# Altium schematic sheet mega2560pro_IoT_schematic.schdoc
size A3
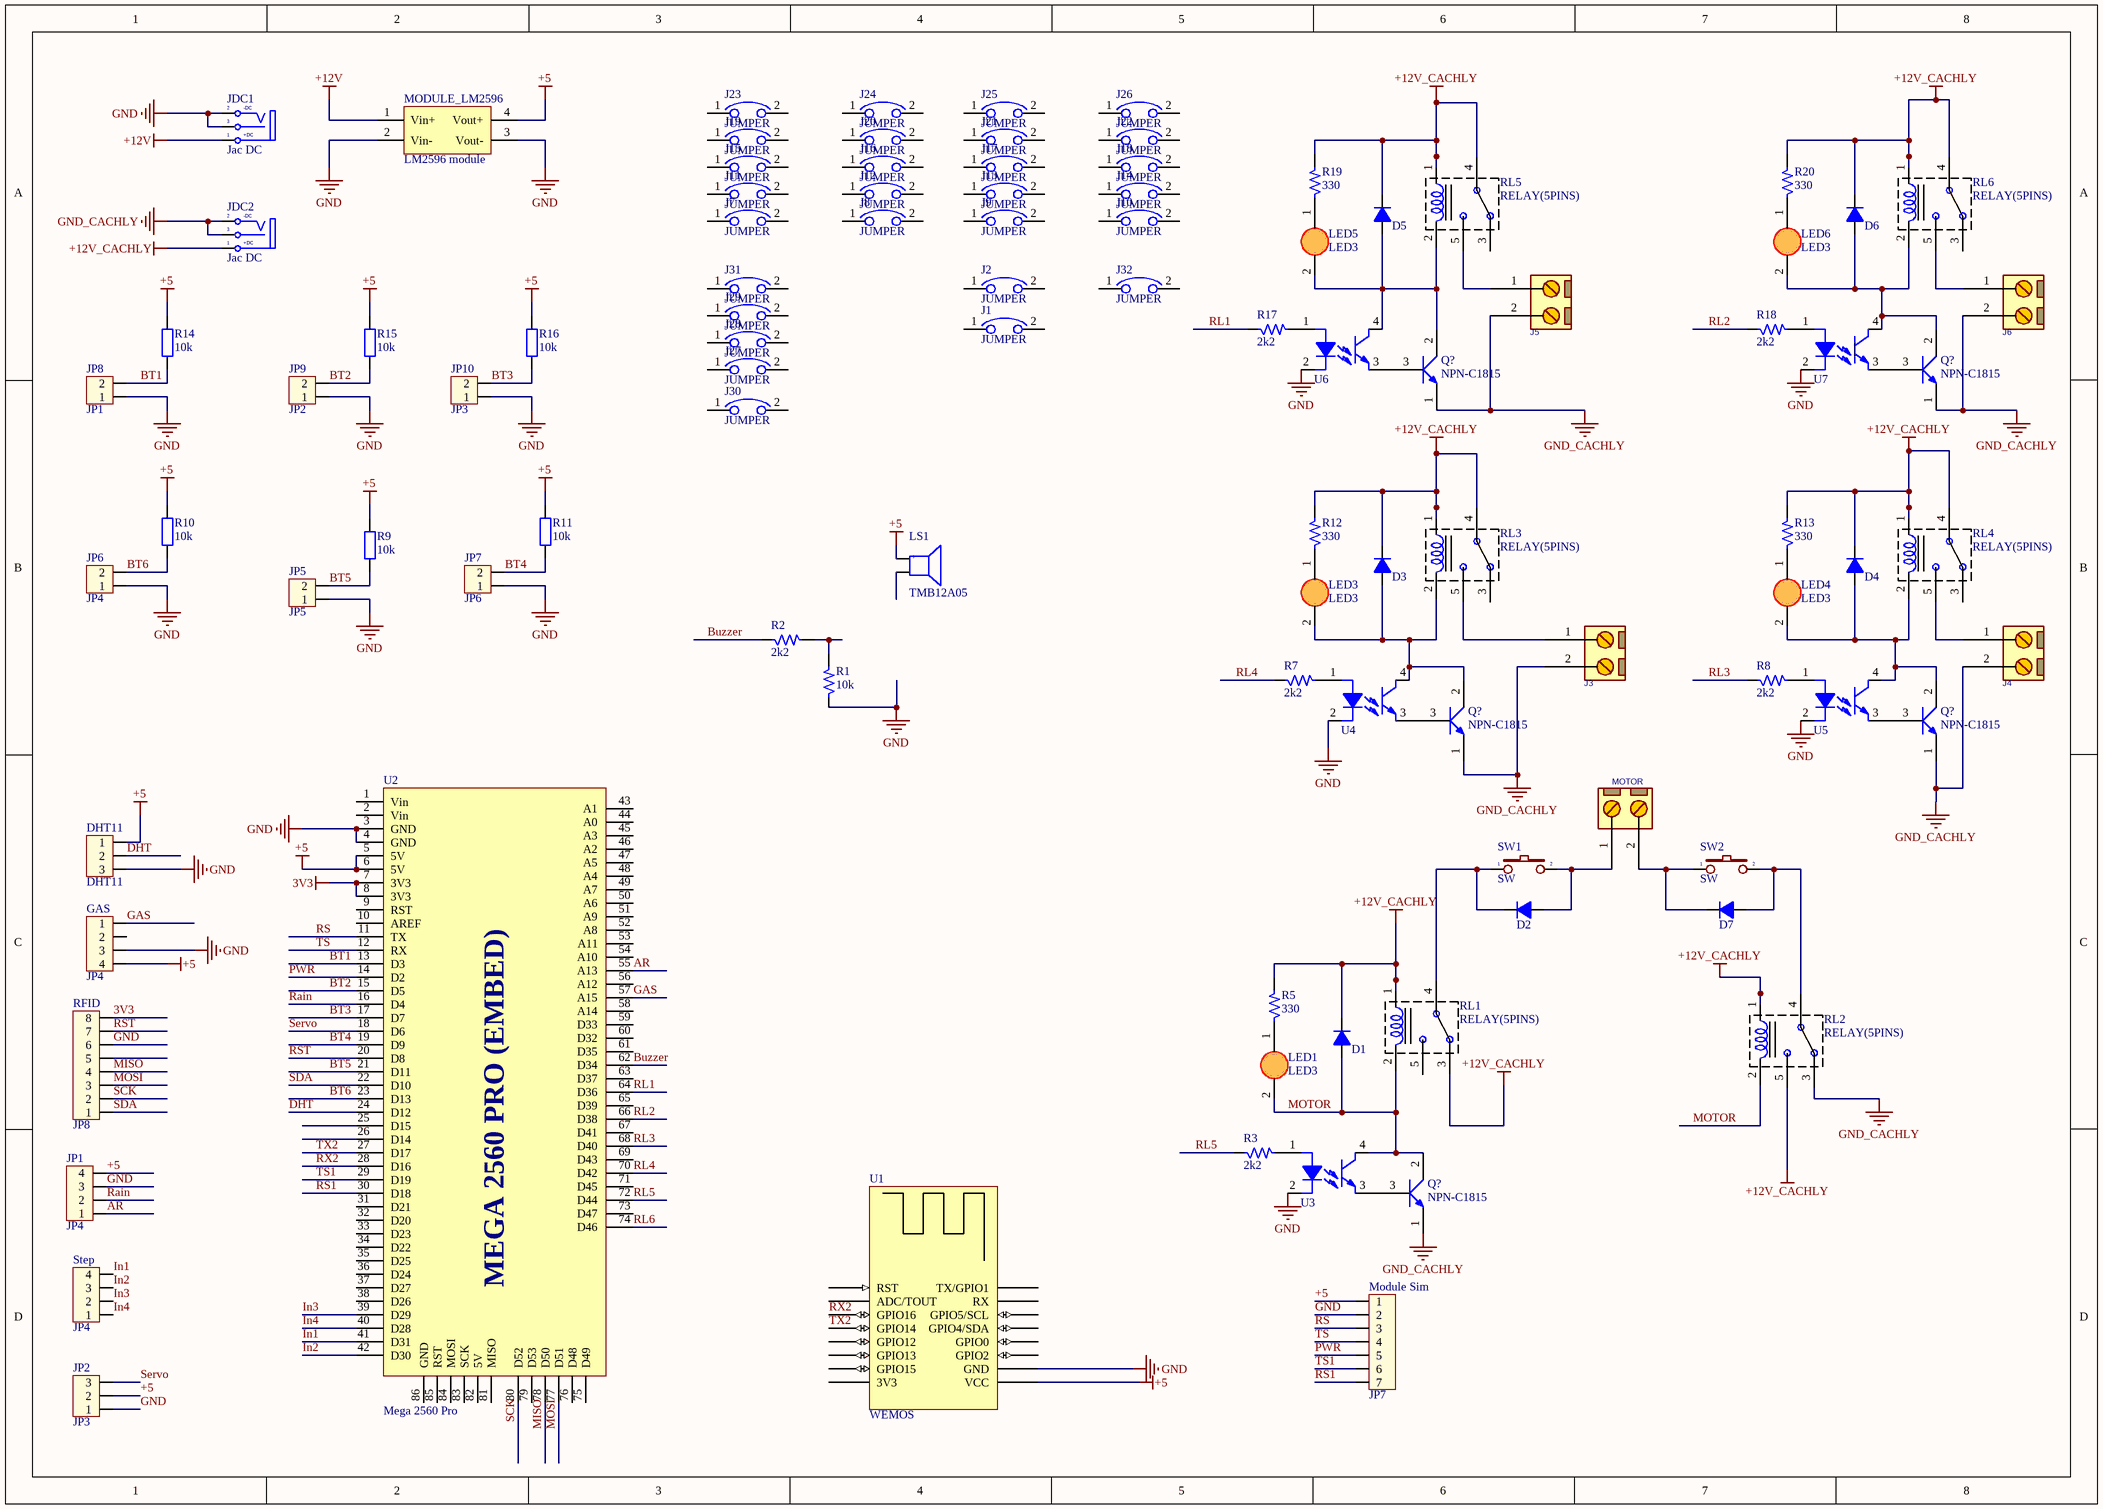
[diagram p0: mega2560pro_IoT_schematic.schdoc]

## Parts
(Parts that share a designator on the sheet are numbered #1, #2 ... from top to bottom, then left to right.)
D1  Diode  [DIODE4007_350MIL]  (value not drawn)
D2  Diode  [DIODE4007_350MIL]  (value not drawn)
D3  Diode  [DIODE4007_350MIL]  (value not drawn)
D4  Diode  [DIODE4007_350MIL]  (value not drawn)
D5  Diode  [DIODE4007_350MIL]  (value not drawn)
D6  Diode  [DIODE4007_350MIL]  (value not drawn)
D7  Diode  [DIODE4007_350MIL]  (value not drawn)
DHT11  DHT11  [CON3]
GAS  JP4  [CON4]
J1  JUMPER  [jumper 15mm]
J2  JUMPER  [jumper 15mm]
J3  CONN_TB2  [Medium - Header 2]  (value not drawn)
J4  CONN_TB2  [Medium - Header 2]  (value not drawn)
J5  CONN_TB2  [Medium - Header 2]  (value not drawn)
J6  CONN_TB2  [Medium - Header 2]  (value not drawn)
J7  JUMPER  [jumper 5mm]
J8  JUMPER  [jumper 10mm]
J9  JUMPER  [jumper 6mm]
J10  JUMPER  [jumper 20mm]
J11  JUMPER  [jumper 5mm]
J12  JUMPER  [jumper 10mm]
J13  JUMPER  [jumper 15mm]
J14  JUMPER  [jumper 15mm]
J15  JUMPER  [jumper 5mm]
J16  JUMPER  [jumper 10mm]
J17  JUMPER  [jumper 15mm]
J18  JUMPER  [jumper 20mm]
J19  JUMPER  [jumper 5mm]
J20  JUMPER  [jumper 10mm]
J21  JUMPER  [jumper 8mm]
J22  JUMPER  [jumper 10mm]
J23  JUMPER  [jumper 5mm]
J24  JUMPER  [jumper 18mm]
J25  JUMPER  [jumper 15mm]
J26  JUMPER  [jumper 8mm]
J27  JUMPER  [jumper 10mm]
J28  JUMPER  [jumper 20mm]
J29  JUMPER  [jumper 10mm]
J30  JUMPER  [jumper 15mm]
J31  JUMPER  [jumper 10mm]
J32  JUMPER  [jumper 20mm]
JDC1  Jac DC  [DC-IN]
JDC2  Jac DC  [DC-IN]
JP1  JP4  [CON4(XH)]
JP2  JP3  [CON3]
JP5  JP5  [CON2]
JP6  JP4  [CON2]
JP7  JP6  [CON2]
JP8  JP1  [CON2]
JP9  JP2  [CON2]
JP10  JP3  [CON2]
LED1  LED3  [LED3mm]
LED3  LED3  [LED3mm]
LED4  LED3  [LED3mm]
LED5  LED3  [LED3mm]
LED6  LED3  [LED3mm]
LS1  TMB12A05  [Buzzer]
MODULE_LM2596  LM2596 module  [Module-2596]
Module_Sim  JP7  [CON7(XH)]
MOTOR  CONN_TB2  [Medium - Header 2]  (value not drawn)
Q?#1  NPN-C1815  [TO126-ECB(D882)]
Q?#2  NPN-C1815  [TO126-ECB(D882)]
Q?#3  NPN-C1815  [TO126-ECB(D882)]
Q?#4  NPN-C1815  [TO126-ECB(D882)]
Q?#5  NPN-C1815  [TO126-ECB(D882)]
R1  10k  [R1/4W_350MIL]
R2  2k2  [R1/4W_350MIL]
R3  2k2  [R1/4W_350MIL]
R5  330  [R1/4W_350MIL]
R7  2k2  [R1/4W_350MIL]
R8  2k2  [R1/4W_350MIL]
R9  10k  [R1/4W]
R10  10k  [R1/4W]
R11  10k  [R1/4W]
R12  330  [R1/4W_350MIL]
R13  330  [R1/4W_350MIL]
R14  10k  [R1/4W]
R15  10k  [R1/4W]
R16  10k  [R1/4W]
R17  2k2  [R1/4W_350MIL]
R18  2k2  [R1/4W_350MIL]
R19  330  [R1/4W_350MIL]
R20  330  [R1/4W_350MIL]
RFID  JP8  [CON8(XH8)]
RL1  RELAY(5PINS)  [RELAY(YL303H-12VDC-5PINS)]
RL2  RELAY(5PINS)  [RELAY(YL303H-12VDC-5PINS)]
RL3  RELAY(5PINS)  [RELAY(YL303H-12VDC-5PINS)]
RL4  RELAY(5PINS)  [RELAY(YL303H-12VDC-5PINS)]
RL5  RELAY(5PINS)  [RELAY(YL303H-12VDC-5PINS)]
RL6  RELAY(5PINS)  [RELAY(YL303H-12VDC-5PINS)]
Step  JP4  [CON4]
SW1  SW  [SW2]
SW2  SW  [SW2]
U1  WEMOS  [MODULE WEMOS]
U2  Mega 2560 Pro  [Arduino 2560 pro]
U3  PC817  [DIP.100/4/W.300/L.400]  (value not drawn)
U4  PC817  [DIP.100/4/W.300/L.400]  (value not drawn)
U5  PC817  [DIP.100/4/W.300/L.400]  (value not drawn)
U6  PC817  [DIP.100/4/W.300/L.400]  (value not drawn)
U7  PC817  [DIP.100/4/W.300/L.400]  (value not drawn)

## Nets
3V3: RFID.8 U2.7(3V3) U2.8(3V3)
+5: DHT11.1 GAS.4 JP1.4 JP2.2 LS1.1(+) MODULE_LM2596.4(Vout+) Module_Sim.1 R9.2 R10.2 R11.2 R14.2 R15.2 R16.2 U1.15(VCC) U2.5(5V) U2.6(5V)
+12V: JDC1.1(T) MODULE_LM2596.1(Vin+)
+12V_CACHLY: D1.2(K) D3.2(K) D4.2(K) D5.2(K) D6.2(K) JDC2.1(T) R5.2 R12.2 R13.2 R19.2 R20.2 RL1.1 RL1.3 RL2.1 RL2.5 RL3.1 RL3.4 RL4.1 RL4.4 RL5.1 RL5.4 RL6.1 RL6.4
GND: DHT11.3 GAS.3 JDC1.2(TN) JDC1.3(S) JP1.3 JP2.1 JP5.1 JP6.1 JP7.1 JP8.1 JP9.1 JP10.1 MODULE_LM2596.2(Vin-) MODULE_LM2596.3(Vout-) Module_Sim.2 R1.1 RFID.6 U1.16(GND) U2.3(GND) U2.4(GND) U3.2 U4.2 U5.2 U6.2 U7.2
GND_CACHLY: J3.2 J4.2 J5.2 J6.2 JDC2.2(TN) JDC2.3(S) Q?#1.1 Q?#2.1 Q?#3.1 Q?#4.1 Q?#5.1 RL2.3
AR: JP1.1 U2.55(A13)
BT1: JP8.2 R14.1 U2.13(D3)
BT2: JP9.2 R15.1 U2.15(D5)
BT3: JP10.2 R16.1 U2.17(D7)
BT4: JP7.2 R11.1 U2.19(D9)
BT5: JP5.2 R9.1 U2.21(D11)
BT6: JP6.2 R10.1 U2.23(D13)
Buzzer: R2.1 U2.62(D34)
DHT: DHT11.2 U2.24(D12)
GAS: GAS.1 U2.57(A15)
In1: Step.4 U2.41(D31)
In2: Step.3 U2.42(D30)
In3: Step.2 U2.39(D29)
In4: Step.1 U2.40(D28)
MISO: RFID.4 U2.78(D50)
MOSI: RFID.3 U2.77(D51)
MOTOR: D1.1(A) LED1.2(K) Q?#5.2 RL1.2 RL2.2 U3.4
PWR: Module_Sim.5 U2.14(D2)
Rain: JP1.2 U2.16(D4)
RL1: R17.1 U2.64(D36)
RL2: R18.1 U2.66(D38)
RL3: R8.1 U2.68(D40)
RL4: R7.1 U2.70(D42)
RL5: R3.1 U2.72(D44)
RL6: U2.74(D46)
RS: Module_Sim.3 U2.11(TX)
RS1: Module_Sim.7 U2.30(D18)
RST: RFID.7 U2.20(D8)
RX2: U1.3(GPIO16) U2.28(D16)
SCK: RFID.2 U2.80(D52)
SDA: RFID.1 U2.22(D10)
Servo: JP2.3 U2.18(D6)
TS: Module_Sim.4 U2.12(RX)
TS1: Module_Sim.6 U2.29(D19)
TX2: U1.4(GPIO14) U2.27(D17)
NetD2_1: D2.1(A) MOTOR.1 SW1.2
NetD2_2: D2.2(K) RL1.4 SW1.1
NetD3_1: D3.1(A) LED3.2(K) Q?#3.2 RL3.2 U4.4
NetD4_1: D4.1(A) LED4.2(K) Q?#4.2 RL4.2 U5.4
NetD5_1: D5.1(A) LED5.2(K) Q?#1.2 RL5.2 U6.4
NetD6_1: D6.1(A) LED6.2(K) Q?#2.2 RL6.2 U7.4
NetD7_1: D7.1(A) RL2.4 SW2.2
NetD7_2: D7.2(K) MOTOR.2 SW2.1
NetJ3_1: J3.1 RL3.5
NetJ4_1: J4.1 RL4.5
NetJ5_1: J5.1 RL5.5
NetJ6_1: J6.1 RL6.5
NetLED1_1: LED1.1(A) R5.1
NetLED3_1: LED3.1(A) R12.1
NetLED4_1: LED4.1(A) R13.1
NetLED5_1: LED5.1(A) R19.1
NetLED6_1: LED6.1(A) R20.1
NetQ?#1_3: Q?#1.3 U6.3
NetQ?#2_3: Q?#2.3 U7.3
NetQ?#3_3: Q?#3.3 U4.3
NetQ?#4_3: Q?#4.3 U5.3
NetQ?#5_3: Q?#5.3 U3.3
NetR1_2: R1.2 R2.2
NetR3_2: R3.2 U3.1
NetR7_2: R7.2 U4.1
NetR8_2: R8.2 U5.1
NetR17_2: R17.2 U6.1
NetR18_2: R18.2 U7.1

Not connected (* = marked no-connect by the designer): GAS 2; J1 1 2; J2 1 2; J7 1 2; J8 1 2; J9 1 2; J10 1 2; J11 1 2; J12 1 2; J13 1 2; J14 1 2; J15 1 2; J16 1 2; J17 1 2; J18 1 2; J19 1 2; J20 1 2; J21 1 2; J22 1 2; J23 1 2; J24 1 2; J25 1 2; J26 1 2; J27 1 2; J28 1 2; J29 1 2; J30 1 2; J31 1 2; J32 1 2; LS1 2(-); RFID 5; RL1 5; RL3 3; RL4 3; RL5 3; RL6 3; U1 1(RST) 2(ADC/TOUT) 5(GPIO12) 6(GPIO13) 7(GPIO15) 8(3V3) 17(GPIO2) 18(GPIO0) 19(GPIO4/SDA) 20(GPIO5/SCL) 21(RX) 22(TX/GPIO1); U2 1(Vin) 2(Vin) 9(RST) 10(AREF) 25(D15) 26(D14) 31(D21) 32(D20) 33(D23) 34(D22) 35(D25) 36(D24) 37(D27) 38(D26) 43(A1) 44(A0) 45(A3) 46(A2) 47(A5) 48(A4) 49(A7) 50(A6) 51(A9) 52(A8) 53(A11) 54(A10) 56(A12) 58(A14) 59(D33) 60(D32) 61(D35) 63(D37) 65(D39) 67(D41) 69(D43) 71(D45) 73(D47) 75(D49) 76(D48) 79(D53) 81(MISO) 82(5V) 83(SCK) 84(MOSI) 85(RST) 86(GND)

## Notes on the sheet
- Title
- Size:
- Date:
- A3
- Number:
- Time:
- Revision:
- Sheet
- of
- File:
- (in symbol DCIN) -DC; +DC
- (in symbol MEGA 2560 Pro mini) MEGA 2560 PRO (EMBED)

## Library data of the parts
D1-D7 = Diode: Vendor: Digikey; Value: FRxxx; Published: 8-Jun-2000; LatestRevisionDate: 17-Jul-2002; LatestRevisionNote: Re-released for DXP Platform.; DatasheetDocument: 1997; PackageReference: DO-35; Publisher: Altium Limited; Code_JEDEC: DO-204-AH; ComponentLink1Description: Digikey Part Link; ComponentLink1URL: http://www.fairchildsemi.com/; ComponentLink2Description: Open Datasheet; ComponentLink2URL: H:\LIBRARY\LIBRARY.Datasheet\ds26003.pdf
DHT11 JP2 = Con3: Connector 3; Value: Connector 3
GAS JP1 Step = Con4: Connector 4; Value: Connector 4
J1 J2 J7-J32 = jumper selector
J3-J6 MOTOR = CONN_TB2: CONN, TERMINAL BLOCK, 5.08mm pitch; VALUE: CONN_TB2
JDC1 JDC2 = DCIN: Jac DC input; Value: Jac DC
JP5-JP10 = Con2: Connector 2; Value: Connector 2
LED1 LED3-LED6 = LED 3mm
LS1 = Buzz: Buzzer >= 80dB, 5V
Module_Sim = Con7: Connector 7; Value: Connector 7
Q?#1-Q?#5 = NPN-ECB(C1815,C2383,D882)
R1-R3 R5 R7-R20 = R1/4W: Resistor 1/4W; Value: R1/4W - 1K
RFID = Con8: Connector 8; Value: Connector 8
SW1 SW2 = SW2: Switch button 2 pin; Value: SW chip 2 pin
U1 = WEMOS D1 ESP8266
U2 = MEGA 2560 Pro mini
U3-U7 = PC817: Opto Couple; Vendor: Digikey; Fc: 80Khz; Published: 13-April-2009; Publisher: Hoang Nguyen; ComponentLink1Description: Digikey Part Link; ComponentLink2Description: Open Datasheet; ComponentLink2URL: H:\LIBRARY\LIBRARY.Datasheet\ds_PC817.pdf